# EAGLE schematic covox (EAGLE 9.5.2)
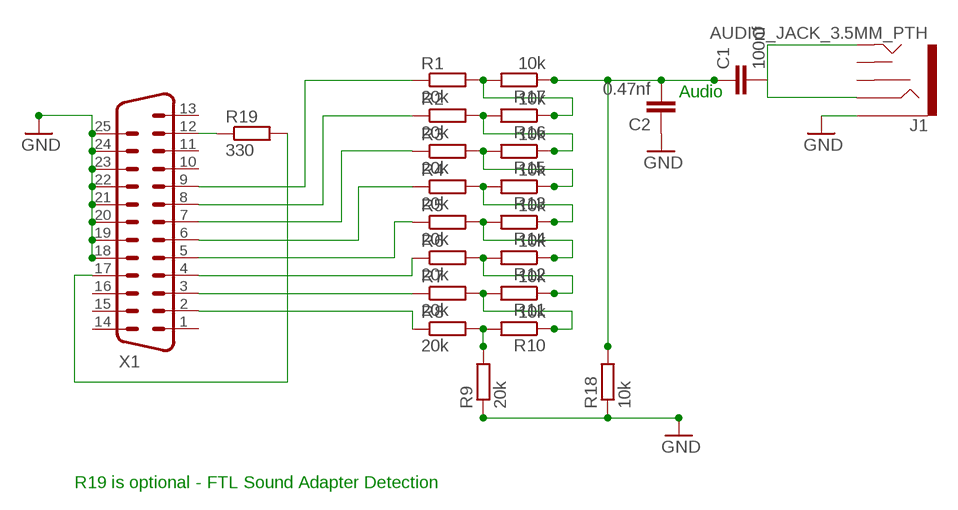
[diagram p0: schematic, sheet 1]

## Parts
C1  100nf  C2.5/2  [C2.5-2]
C2  0.47nf  C2.5/2  [C2.5-2]
J1  AUDIO_JACK_3.5MM_PTH  [AUDIO-JACK]
R1  20k  R-EU_0204/7  [0204/7]
R2  20k  R-EU_0204/7  [0204/7]
R3  20k  R-EU_0204/7  [0204/7]
R4  20k  R-EU_0204/7  [0204/7]
R5  20k  R-EU_0204/7  [0204/7]
R6  20k  R-EU_0204/7  [0204/7]
R7  20k  R-EU_0204/7  [0204/7]
R8  20k  R-EU_0204/7  [0204/7]
R9  20k  R-EU_0204/7  [0204/7]
R10  10k  R-EU_0204/7  [0204/7]
R11  10k  R-EU_0204/7  [0204/7]
R12  10k  R-EU_0204/7  [0204/7]
R13  10k  R-EU_0204/7  [0204/7]
R14  10k  R-EU_0204/7  [0204/7]
R15  10k  R-EU_0204/7  [0204/7]
R16  10k  R-EU_0204/7  [0204/7]
R17  10k  R-EU_0204/7  [0204/7]
R18  10k  R-EU_0204/7  [0204/7]
R19  330  R-EU_0204/7  [0204/7]
X1  M25HP  [M25HP]

## Nets
GND: C2.1 J1.SLEEVE R9.1 R18.1 X1.18 X1.19 X1.20 X1.21 X1.22 X1.23 X1.24 X1.25
N$1: R8.2 R9.2 R10.2
N$2: R7.2 R10.1 R11.2
N$3: R6.2 R11.1 R12.2
N$4: R4.2 R13.2 R14.1
N$5: C1.2 J1.RING J1.TIP
N$6: R3.2 R13.1 R15.2
N$7: R2.2 R15.1 R16.2
N$8: R1.2 R16.1 R17.2
N$9: R8.1 X1.2
N$10: R7.1 X1.3
N$11: C1.1 C2.2 R17.1 R18.2
N$12: R6.1 X1.4
N$13: R5.1 X1.5
N$14: R4.1 X1.6
N$15: R3.1 X1.7
N$16: R2.1 X1.8
N$17: R5.2 R12.1 R14.2
N$18: R1.1 X1.9
N$19: R19.2 X1.17
N$20: R19.1 X1.12
Unconnected: J1.RSH J1.TSH X1.1 X1.10 X1.11 X1.13 X1.14 X1.15 X1.16

## Notes on the sheet
- Audio
- R19 is optional - FTL Sound Adapter Detection

## Library data of the parts
C1 C2 = capacitor-wima:C: CAPACITOR naming: grid - package width
J1 = SparkFun-Connectors:AUDIO_JACK_3.5MM: Audio Jack 3.5mm variants of PTH and SMT stereo audio jack with bypass switches. SparkFun Products: SparkFun SparkPunk Sound Kit <[https://www.sparkfun.com/products/11177]> - PTH MP3 Trigger <https://www.sparkfun.com/products/13720> -3.5mm SMD SparkFun PicoBoard <https://www.sparkfun.com/products/11888>- 2.5mm SMD; PROD_ID: CONN-08774; SF_ID: PRT-08032
R1-R19 = rcl:R-EU_: RESISTOR, European symbol
X1 = con-subd:M25: SUB-D; OC_FARNELL: unknown; OC_NEWARK: unknown